# EAGLE design driver-ha-v1 (EAGLE 7.2.0)
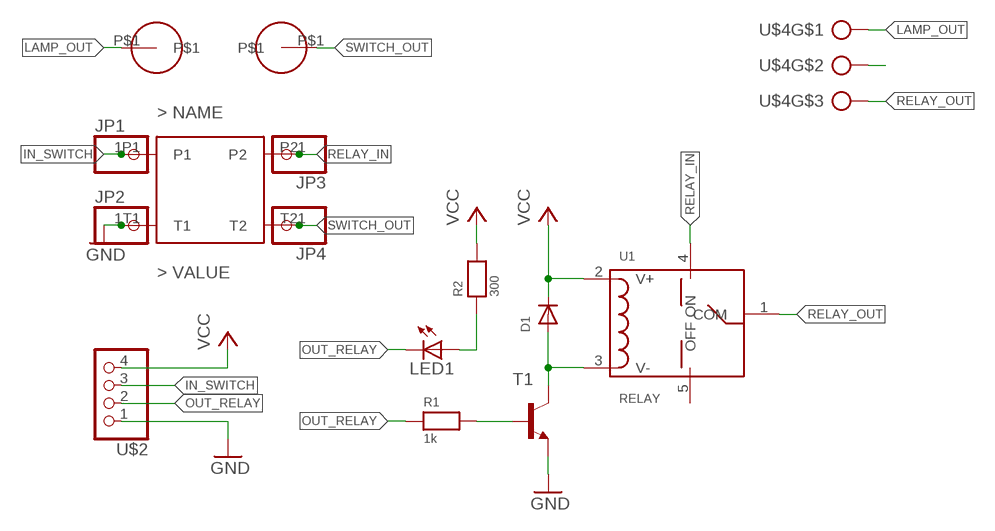
[diagram p0: schematic, sheet 1]

## Parts
D1  DIODESMA  [SMADIODE]
JP1  PINHD-1X1  [1X01]
JP2  PINHD-1X1  [1X01]
JP3  PINHD-1X1  [1X01]
JP4  PINHD-1X1  [1X01]
LED1  LEDCHIPLED_0805  [CHIPLED_0805]
R1  1k  RESISTOR0603  [0603]
R2  300  RESISTOR0603  [0603]
ROOM_SWITCH  DPST-SWITCH-1221  [TOGGLE-SW-E1221]
T1  MMBT2222ALT1-NPN-SOT23-BEC  [SOT23-BEC]
U1  RELAY  [RELAY]
U$1  CONN-CABLE  [CONN-CABLE]
U$2  HEADER-1X4  [1X04_OVAL]
U$3  CONN-CABLE  [CONN-CABLE]
U$4  AK3003  [AK3003]

## Nets
GND: JP2.1 ROOM_SWITCH.T1 T1.E U$2.1
IN_SWITCH: JP1.1 ROOM_SWITCH.P1 U$2.3
LAMP_OUT: U$1.P$1 U$4.1
N$1: R1.2 T1.B
N$2: LED1.A R2.1
N$3: D1.A T1.C U1.3(V-)
N$6: U$4.2
OUT_RELAY: LED1.C R1.1 U$2.2
RELAY_IN: JP3.1 ROOM_SWITCH.P2 U1.4(ON)
RELAY_OUT: U1.1(COM) U$4.3
SWITCH_OUT: JP4.1 ROOM_SWITCH.T2 U$3.P$1
VCC: D1.C R2.2 U1.2(V+) U$2.4
Unconnected: U1.5(OFF)

## Library data of the parts
D1 = adafruit:DIODE: Diode SMADIODE - SMA Surface Mount Package 20V 1A Schottky Diode Digikey: 641-1014-6-ND DO-1N4148 - Through Hole Small Current Diode SOD-123 20V 1 A (.5mV Vf) Schottky Diode - Digikey: MBRX120TPMSCT-ND SOD-323 10V 570mA (.38mV Vf, 3ns) Schottky Diode - Digikey: ZLLS410CT-ND SOD-523 30V 30mA Schottky Diode (RB751S-40TE61) - Digikey: RB751S-40TE61CT-ND SOT23-R/W - SOT23 Package (R = Solder Paste/Reflow Ovens, W = Hand-Soldering) BAT54Film 40V 300mA - Digikey: 497-7162-1-ND
JP1-JP4 = pinhead:PINHD-1X1: PIN HEADER
LED1 = adafruit:LED: LED OSRAM: - CHIPLED LG R971, LG N971, LY N971, LG Q971, LY Q971, LO R971, LY R971 LH N974, LH R974 LS Q976, LO Q976, LY Q976 LO Q996 - Hyper CHIPLED LW Q18S LB Q993, LB Q99A, LB R99A - SideLED LS A670, LO A670, LY A670, LG A670, LP A670 LB A673, LV A673, LT A673, LW A673 LH A674 LY A675 LS A676, LA A676, LO A676, LY A676, LW A676 LS A679, LY A679, LG A679 - Hyper Micro SIDELED® LS Y876, LA Y876, LO Y876, LY Y876 LT Y87S - SmartLED LW L88C, LW L88S LB L89C, LB L89S, LG L890 LS L89K, LO L89K, LY L89K LS L896, LA L896, LO L896, LY L896 - TOPLED LS T670, LO T670, LY T670, LG T670, LP T670 LSG T670, LSP T670, LSY T670, LOP T670, LYG T670 LG T671, LOG T671, LSG T671 LB T673, LV T673, LT T673, LW T673 LH T674 LS T676, LA T676, LO T676, LY T676, LB T676, LH T676, LSB T676, LW T676 LB T67C, LV T67C, LT T67C, LS T67K, LO T67K, LY T67K, LW E67C LS E67B, LA E67B, LO E67B, LY E67B, LB E67C, LV E67C, LT E67C LW T67C LS T679, LY T679, LG T679 LS T770, LO T770, LY T770, LG T770, LP T770 LB T773, LV T773, LT T773, LW T773 LH T774 LS E675, LA E675, LY E675, LS T675 LS T776, LA T776, LO T776, LY T776, LB T776 LHGB T686 LT T68C, LB T68C - Hyper Mini TOPLED® LB M676 - Mini TOPLED Santana® LG M470 LS M47K, LO M47K, LY M47K Source: http://www.osram.convergy.de/
R1 R2 = microbuilder:RESISTOR: Resistors 0402 - 0402 Surface Mount Package 22 Ohm 1% 1/16W [Digikey: 311-22.0LRTR-ND] 33 Ohm 5% 1/16W 1.0K 5% 1/16W 1.5K 5% 1/16W 2.0K 1% 1/16W 10.0K 1% 1/16W [Digikey: 311-10.0KLRTR-ND] 10.0K 5% 1/16W [Digikey: RMCF0402JT10K0TR-ND] 12.1K 1% 1/16W [Digikey: 311-22.0LRTR-ND] 100.0K 5% 1/16W 0603 - 0603 Surface Mount Package 0 Ohm 1/10 Watt 1% Resistor 15 Ohm 1/10 Watt 1% Resistor 33 Ohm 1/10 Watt 1% Resistor 49.9 Ohm 1/10 Watt 1% Resistor 100 Ohm 1/10 Watt 1% Resistor 150 Ohm 1/10 Watt 1% Resistor 240 Ohm 1/10 Watt 1% Resistor 390 Ohm 1/10 Watt 1% Resistor 560 Ohm 1/10 Watt 1% Resistor 680 Ohm 1/10 Watt 1% Resistor 750 Ohm 1/10 Watt 1% Resistor 1.0K Ohm 1/10 Watt 1% Resistor 1.5K Ohm 1/10 Watt 1% Resistor 2.0K Ohm 1/10 Watt 1% Resistor 2.2K Ohm 1/10 Watt 1% Resistor 3.3K Ohm 1/10 Watt 1% Resistor 4.7K Ohm 1/10 Watt 1% Resistor 10.0K Ohm 1/10 Watt 1% Resistor 12.0K Ohm 1/10 Watt 1% Resistor 12.1K Ohm 1/10 Watt 1% Resistor 20.0K Ohm 1/10 Watt 1% Resistor 33.0K Ohm 1/10 Watt 1% Resistor 100.0K Ohm 1/10 Watt 1% Resistor 0805 - 0805 Surface Mount Package 0 Ohm 1/8 Watt 1% Resistor 33 Ohm 1/8 Watt 1% Resistor 100 Ohm 1/8 Watt 1% Resistor 150 Ohm 1/8 Watt 1% Resistor 200 Ohm 1/8 Watt 1% Resistor 240 Ohm 1/8 Watt 1% Resistor 330 Ohm 1/8 Watt 1% Resistor 390 Ohm 1/8 Watt 1% Resistor 470 Ohm 1/8 Watt 1% Resistor 1.0K Ohm 1/8 Watt 1% Resistor 1.5K Ohm 1/8 Watt 1% Resistor 2.0K Ohm 1/8 Watt 1% Resistor 4.7K Ohm 1/8 Watt 1% Resistor 5.1K Ohm 1/8 Watt 1% Resistor 5.6K Ohm 1/8 Watt 1% Resistor 10.0K Ohm 1/8 Watt 1% Resistor 22.0K Ohm 1/8 Watt 1% Resistor 33.0K Ohm 1/8 Watt 1% Resistor 100K Ohm 1/8 Watt 1% Resistor 1206 - 1206 Surface Mount Package 2012 - 2010 Surface Mount Package 0.11 Ohm 1/2 Watt 1% Resistor - Digikey: RHM.11UCT-ND
ROOM_SWITCH = bontor:DPST-SWITCH-1221
T1 = transistor-neu-to92:*-NPN-: NPN Transistror
U1 = Itead_BP_110825:RELAY: BAS003
U$1 U$3 = bontor:CONN-CABLE
U$2 = microbuilder:HEADER-1X4: PIN HEADER
U$4 = con-ptr500:AK3003

## Board
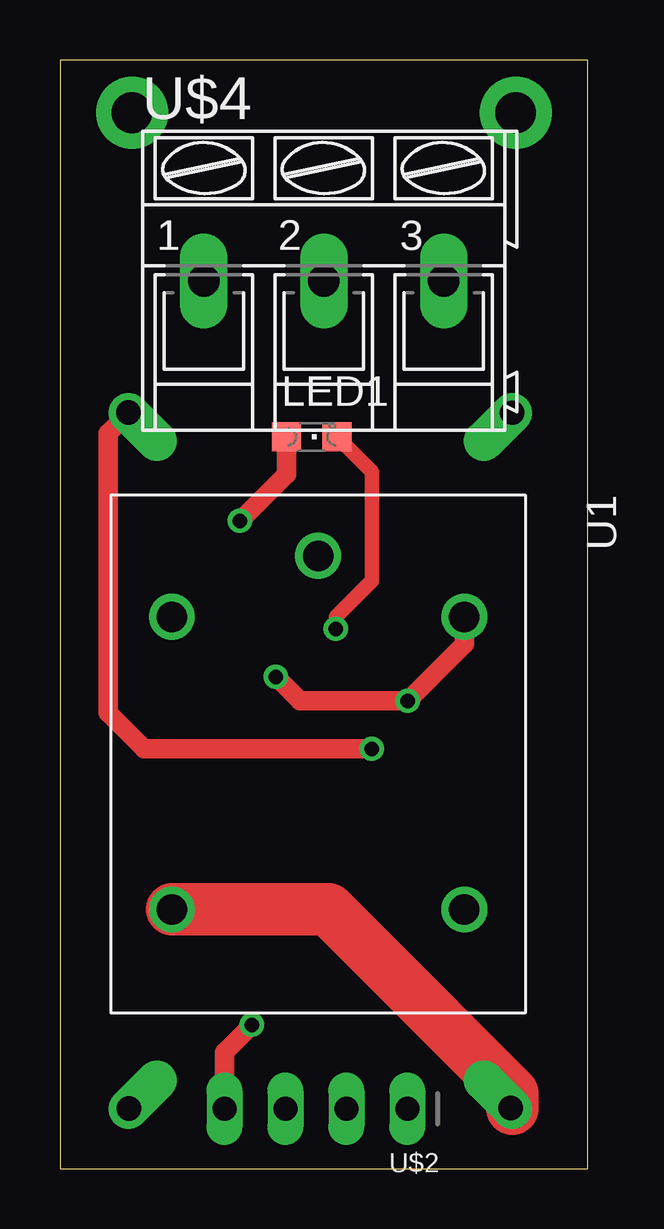
[diagram p1: board, top side]
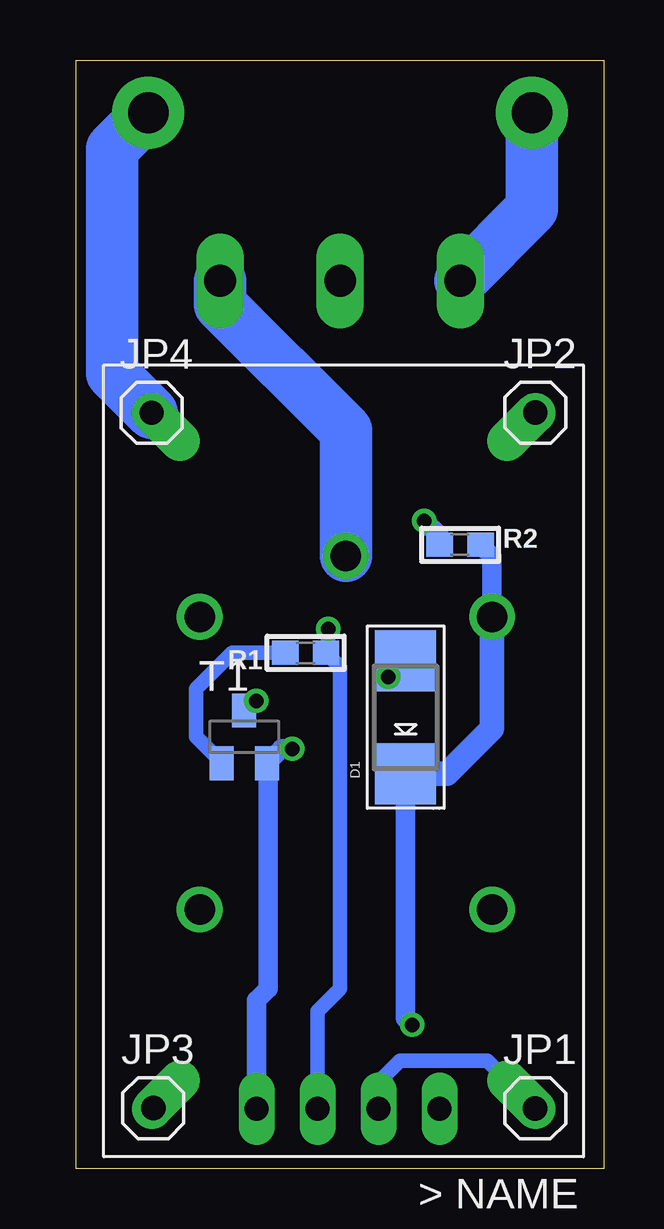
[diagram p2: board, bottom side, seen from below]

Size 22 x 46.2 mm. Coordinates in mm from the lower left corner, seen from the top.
Outline: 0,0 22,0 22,46.2 0,46.2 0,0
Copper layers (1*16): Top 0.035mm / dielectric 1.5mm / Bottom 0.035mm
Design rules "default": minimum track width 10mil, minimum drill 24mil, track to track 8mil, track to pad 8mil, pad to pad 8mil, via to via 8mil, smd to smd 8mil, copper to edge 40mil, drill to drill 8mil, minimum pad ring 10mil, minimum via ring 8mil, stop-mask expansion 4mil, vias tented up to drill 0mil, thermal gap 10mil

### Footprints (pad centres in the part's own frame; a part is rotated, then mirrored left to right if it is on the bottom)
SMADIODE = smd 2.54 x 2.54: A 2.349,0; C -2.349,0
1X01 = drill 1.016 octagon: 1 0,0
CHIPLED_0805 = smd 1.2 x 1.2: A 0,-1.05; C 0,1.05
0603 = smd 1.1 x 1: 1 -0.85,0; 2 0.85,0
TOGGLE-SW-E1221 = drill 0.8 pad 1.676 offset: P1 -8,14.5; P2 8,14.5; T1 -8,-14.5; T2 8,-14.5
SOT23-BEC = smd 1 x 1.4: B -0.95,-1.1; C 0,1.1; E 0.95,-1.1
RELAY = drill 1.27: 1 -8.54,-0.096; 2 -6,-6.192; 3 -6,6; 4 6.192,-6.192; 5 6.192,6
CONN-CABLE = drill 1.7 pad 3: P$1 0,0
1X04_OVAL = drill 1 long: 1 -3.81,0; 2 -1.27,0; 3 1.27,0; 4 3.81,0
AK3003 = drill 1.321 long: 1 -5.004,0; 2 0,0; 3 5.004,0

### Placement (x,y rotation side)
D1  8.27,18.81 90 bottom
JP1  2.87,2.52 0 bottom
JP2  2.86,31.51 0 bottom
JP3  18.79,2.53 0 bottom
JP4  18.86,31.5 0 bottom
LED1  10.5,30.5 270 top
R1  12.44,21.5 180 bottom
R2  6,26 0 bottom
ROOM_SWITCH  10.86,17 180 bottom
T1  15,18 0 bottom
U1  10.86,17 270 top
U$1  3,44 0 top
U$2  10.67,2.5 180 top
U$3  19,44 0 top
U$4  11,37 0 top

### Tracks (layer width: path | path; a pad name or v marks a point on that pad's centre or on a via)
GND  (via drill 0.6)
  Top 0.406: ROOM_SWITCH.T1 JP2.1
  Top 0.813: ROOM_SWITCH.T1 2,30.64 2,19 3.5,17.5 v13,17.5
  Bottom 0.813: v13,17.5 13.45,17.5 T1.E 14,16.85 14,7.5 14.48,7.02 U$2.1
IN_SWITCH
  Bottom 0.406: ROOM_SWITCH.P1 JP1.1
  Bottom 0.61: ROOM_SWITCH.P1 4.86,4.5 8.5,4.5 9.4,3.6 U$2.3
LAMP_OUT
  Bottom 2.184: U$1.P$1 3,42.5 3,42 3,40 U$4.1
N$1
  Bottom 0.61: R1.2 15.5,21.5 17,20 17,18 15.95,16.95 T1.B
N$2  (via drill 0.6)
  Top 0.813: v7.5,27 9.45,28.95 LED1.A
  Bottom 0.813: R2.1 6.85,26.35 v7.5,27
N$3  (via drill 0.6)
  Top 0.813: U1.3 16.86,21.86 v14.5,19.5 10,19.5 v9,20.5
  Bottom 0.813: T1.C 14.9,19.1 v14.5,19.5 | D1.A 8.93,20.5 v9,20.5
OUT_RELAY  (via drill 0.6)
  Top 0.61: LED1.C 13,29.05 13,24.5 11.5,23 v11.5,22.5
  Bottom 0.61: v11.5,22.5 11.5,21.59 arc90 R1.1 11,20.91 11,7.5 11.94,6.56 U$2.2
RELAY_IN
  Top 0.406: ROOM_SWITCH.P2 18.79,2.5 JP3.1
  Top 2.184: U1.4 11.19,10.81 18.86,3.14 ROOM_SWITCH.P2
RELAY_OUT
  Bottom 2.184: U1.1 10.76,30.76 16,36 U$4.3
SWITCH_OUT
  Bottom 2.184: JP4.1 20.5,33.14 20.5,42.5 U$3.P$1
VCC  (via drill 0.6)
  Top 0.813: v8,6 6.86,4.86 U$2.4
  Bottom 0.813: D1.C 8.27,6.27 v8,6 | U1.2 4.67,25.52 R2.2
  Bottom 1.016: U1.2 4.67,18.33 6.54,16.46 D1.C